# Altium project UNReLo End Node.PrjPcb (part 1 of 2)
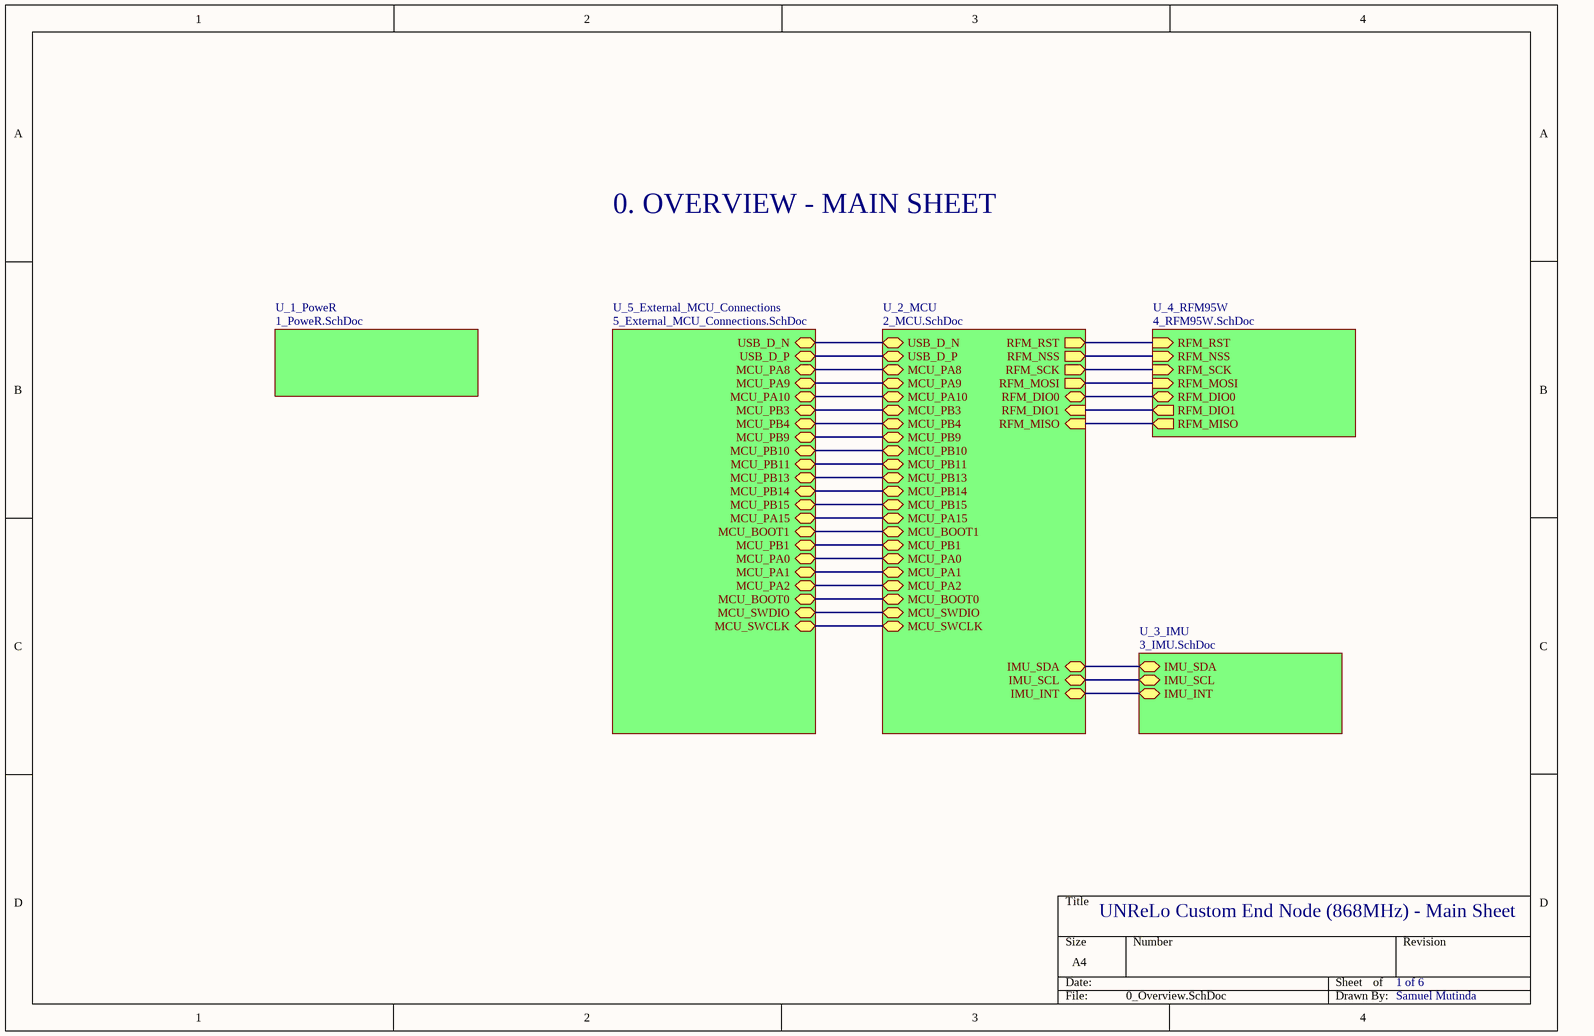
[diagram p0: 0_Overview.SchDoc]
6 sheets, 54 parts. Net scope: hierarchical (ports join the sheet entries above them; power ports are global).
Board file: UNReLo End Node PCB.PcbDoc
Sheets:
  0_Overview.SchDoc
    U_1_PoweR = 1_Power.SchDoc
    U_2_MCU = 2_MCU.SchDoc
    U_3_IMU = 3_IMU.SchDoc
    U_4_RFM95W = 4_RFM95W.SchDoc
    U_5_External_MCU_Connections = 5_External_MCU_Connections.SchDoc

## Sheet 0_Overview.SchDoc
size A4; SheetNumber: 1; SheetTotal: 6

### Sub-sheets
U_1_PoweR = 1_PoweR.SchDoc: no entries
U_2_MCU = 2_MCU.SchDoc: RFM_DIO0 (bidir), RFM_RST (out), RFM_NSS (out), RFM_SCK (out), RFM_MOSI (out), RFM_MISO (in), RFM_DIO1 (in), USB_D_N (bidir), USB_D_P (bidir), MCU_PA8 (bidir), MCU_PA9 (bidir), MCU_PA10 (bidir), MCU_PB3 (bidir), MCU_PB4 (bidir), MCU_PB9 (bidir), MCU_PB10 (bidir), MCU_PB11 (bidir), MCU_PB13 (bidir), MCU_PB14 (bidir), MCU_PB15 (bidir), MCU_PA15 (bidir), MCU_BOOT1 (bidir), MCU_PB1 (bidir), MCU_PA0 (bidir), MCU_PA1 (bidir), MCU_PA2 (bidir), MCU_BOOT0 (bidir), MCU_SWDIO (bidir), MCU_SWCLK (bidir), IMU_SCL (bidir), IMU_SDA (bidir), IMU_INT (bidir)
U_3_IMU = 3_IMU.SchDoc: IMU_SDA (bidir), IMU_SCL (bidir), IMU_INT (bidir)
U_4_RFM95W = 4_RFM95W.SchDoc: RFM_RST (in), RFM_NSS (in), RFM_SCK (in), RFM_MOSI (in), RFM_MISO (out), RFM_DIO0 (bidir), RFM_DIO1 (out)
U_5_External_MCU_Connections = 5_External_MCU_Connections.SchDoc: USB_D_N (bidir), USB_D_P (bidir), MCU_PA0 (bidir), MCU_PA1 (bidir), MCU_PA2 (bidir), MCU_PB1 (bidir), MCU_PB9 (bidir), MCU_PB10 (bidir), MCU_PB11 (bidir), MCU_PB13 (bidir), MCU_PB14 (bidir), MCU_PB15 (bidir), MCU_PB3 (bidir), MCU_PB4 (bidir), MCU_PA10 (bidir), MCU_PA9 (bidir), MCU_PA8 (bidir), MCU_BOOT0 (bidir), MCU_BOOT1 (bidir), MCU_SWDIO (bidir), MCU_SWCLK (bidir), MCU_PA15 (bidir)

### Nets
IMU_INT: sheet U_2_MCU/IMU_INT, sheet U_3_IMU/IMU_INT
IMU_SCL: sheet U_2_MCU/IMU_SCL, sheet U_3_IMU/IMU_SCL
IMU_SDA: sheet U_2_MCU/IMU_SDA, sheet U_3_IMU/IMU_SDA
MCU_BOOT0: sheet U_2_MCU/MCU_BOOT0, sheet U_5_External_MCU_Connections/MCU_BOOT0
MCU_BOOT1: sheet U_2_MCU/MCU_BOOT1, sheet U_5_External_MCU_Connections/MCU_BOOT1
MCU_PA0: sheet U_2_MCU/MCU_PA0, sheet U_5_External_MCU_Connections/MCU_PA0
MCU_PA1: sheet U_2_MCU/MCU_PA1, sheet U_5_External_MCU_Connections/MCU_PA1
MCU_PA2: sheet U_2_MCU/MCU_PA2, sheet U_5_External_MCU_Connections/MCU_PA2
MCU_PA8: sheet U_2_MCU/MCU_PA8, sheet U_5_External_MCU_Connections/MCU_PA8
MCU_PA9: sheet U_2_MCU/MCU_PA9, sheet U_5_External_MCU_Connections/MCU_PA9
MCU_PA10: sheet U_2_MCU/MCU_PA10, sheet U_5_External_MCU_Connections/MCU_PA10
MCU_PA15: sheet U_2_MCU/MCU_PA15, sheet U_5_External_MCU_Connections/MCU_PA15
MCU_PB1: sheet U_2_MCU/MCU_PB1, sheet U_5_External_MCU_Connections/MCU_PB1
MCU_PB3: sheet U_2_MCU/MCU_PB3, sheet U_5_External_MCU_Connections/MCU_PB3
MCU_PB4: sheet U_2_MCU/MCU_PB4, sheet U_5_External_MCU_Connections/MCU_PB4
MCU_PB9: sheet U_2_MCU/MCU_PB9, sheet U_5_External_MCU_Connections/MCU_PB9
MCU_PB10: sheet U_2_MCU/MCU_PB10, sheet U_5_External_MCU_Connections/MCU_PB10
MCU_PB11: sheet U_2_MCU/MCU_PB11, sheet U_5_External_MCU_Connections/MCU_PB11
MCU_PB13: sheet U_2_MCU/MCU_PB13, sheet U_5_External_MCU_Connections/MCU_PB13
MCU_PB14: sheet U_2_MCU/MCU_PB14, sheet U_5_External_MCU_Connections/MCU_PB14
MCU_PB15: sheet U_2_MCU/MCU_PB15, sheet U_5_External_MCU_Connections/MCU_PB15
MCU_SWCLK: sheet U_2_MCU/MCU_SWCLK, sheet U_5_External_MCU_Connections/MCU_SWCLK
MCU_SWDIO: sheet U_2_MCU/MCU_SWDIO, sheet U_5_External_MCU_Connections/MCU_SWDIO
RFM_DIO0: sheet U_2_MCU/RFM_DIO0, sheet U_4_RFM95W/RFM_DIO0
RFM_DIO1: sheet U_2_MCU/RFM_DIO1, sheet U_4_RFM95W/RFM_DIO1
RFM_MISO: sheet U_2_MCU/RFM_MISO, sheet U_4_RFM95W/RFM_MISO
RFM_MOSI: sheet U_2_MCU/RFM_MOSI, sheet U_4_RFM95W/RFM_MOSI
RFM_NSS: sheet U_2_MCU/RFM_NSS, sheet U_4_RFM95W/RFM_NSS
RFM_RST: sheet U_2_MCU/RFM_RST, sheet U_4_RFM95W/RFM_RST
RFM_SCK: sheet U_2_MCU/RFM_SCK, sheet U_4_RFM95W/RFM_SCK
USB_D_N: sheet U_2_MCU/USB_D_N, sheet U_5_External_MCU_Connections/USB_D_N
USB_D_P: sheet U_2_MCU/USB_D_P, sheet U_5_External_MCU_Connections/USB_D_P

### Notes on the sheet
- 0. OVERVIEW - MAIN SHEET
- UNReLo Custom End Node (868MHz) - Main Sheet
- 1 of 6
- Samuel Mutinda

## Sheet 1_Power.SchDoc
size A4; SheetNumber: 2; SheetTotal: 6
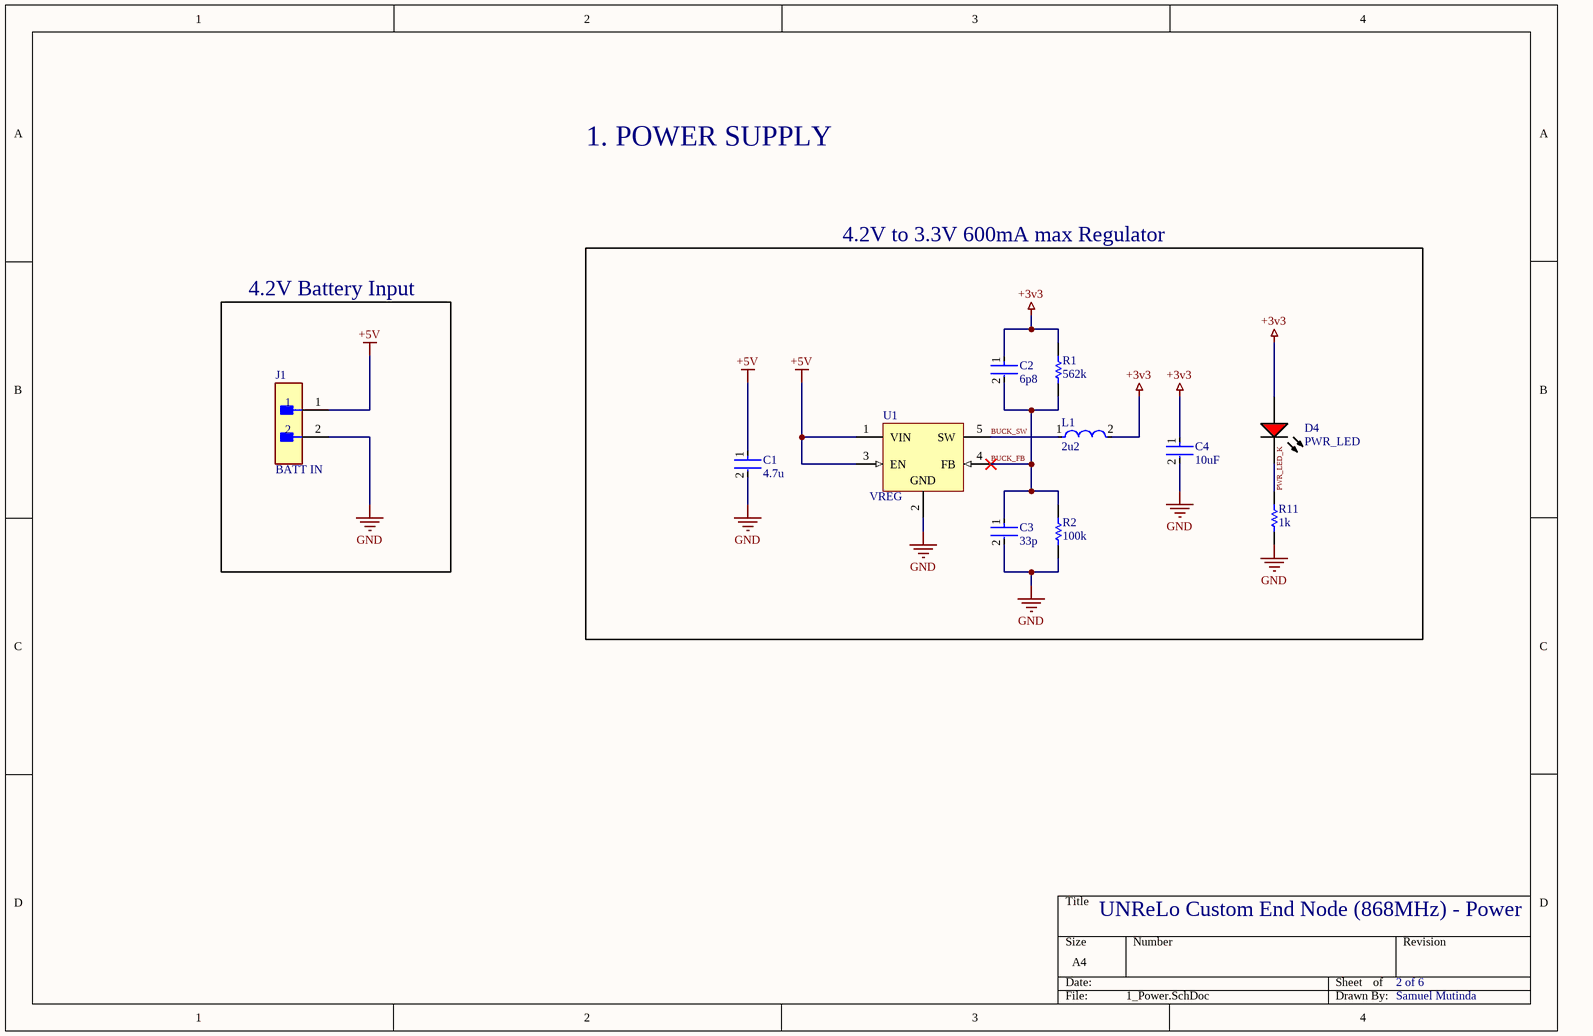
[diagram p1: 1_Power.SchDoc]

### Parts
C1  4.7u  [FP-GRM155-0_1-IPC_B]
C2  6p8  [FP-C0603C-CF-MFG]
C3  33p  [FP-CC0603-0_9-IPC_C]
C4  10uF  [FP-GRM188-0_1-e0_2_0_55-IPC_A]
D4  PWR_LED  [VISH-TLMS1000_V]
J1  BATT IN  [FP-53254-0270-MFG]
L1  2u2  [FP-LQM21PH_G0-IPC_C]
R1  562k  [RESC1609X50X30NL10T20]
R2  100k  [RESC1608X55X30ML20T20]
R11  1k  [RESC1005X40X25NL05T05]
U1  VREG  [DBV0005A_L]

### Blocks framed on the sheet
4.2V Battery Input: J1
4.2V to 3.3V 600mA max Regulator: C1-C4 D4 L1 R1 R2 R11 U1

### Nets
+3v3: C2.1 C4.1 D4.1(A) L1.2 R1.2
+5V: C1.1 J1.1 U1.1(VIN) U1.3(EN)
GND: C1.2 C3.2 C4.2 J1.2 R2.1 R11.1 U1.2(GND)
BUCK_FB: C2.2 C3.1 R1.1 R2.2 U1.4(FB)
BUCK_SW: L1.1 U1.5(SW)
PWR_LED_K: D4.2(K) R11.2

### Notes on the sheet
- 1. POWER SUPPLY
- UNReLo Custom End Node (868MHz) - Power
- 2 of 6
- Samuel Mutinda

### Library data of the parts
C1 = CMP-2008-04549-2: Chip Multilayer Ceramic Capacitors for General Purpose, 0402, 4.7uF, X5R, 15%, 20%, 6.3V; Manufacturer 1: Samsung Electro-Mechanics; Voltage Rating (DC): 16V; Name: CL05A475MO5NUNC; Height: 0.5mm; Weight: 0.000212oz; Length: 1mm; Case Code (Metric): 1005; Packaging: Tape and Reel; Termination: SMD/SMT; Dielectric: X5R; Depth: 0.5mm; Case Code (Imperial): 0402; Min Operating Temperature: -55°C; Case/Package: 0402; Voltage: 6.3V; Width: 0.02inch; Capacitance: 4.7uF; Lead Free: Lead Free; Thickness: 0.022inch; Contact Plating: Tin; REACH SVHC: No SVHC; Package Quantity: 10000; Tolerance: 20%; Voltage Rating: 16V; Mount: Surface Mount; Max Operating Temperature: 85°C; Manufacturer Part Number 1: CL05A475MO5NUNC; Supplier 1: Digi-Key; Supplier Part Number 1: 1276-6836-1-ND; Supplier Unit Price 1: $0.44
C2 = CMP-2006-03271-2: CAP CER 6.8PF 50V NP0 0603; Manufacturer Part Number: C0603C689C5GACTU; Manufacturer: KEMET; Manufacturer 1: TDK Corporation; Manufacturer Part Number 1: C1608CH2A6R8D080AA; Automotive Grade: Grade 1; Temperature Coefficient: 30ppm/°C; Temperature Characteristic: C0G; Tolerance: 0.25 pF; Material: Ceramic; Voltage Rating: 100 V; ComponentLink2URL: https://api.kemet.com/component-edge/download/datasheet/C0603C100J5GACAUTO.pdf; Mouser Description: 0603 C 6.8pF Ceramic Multilayer Capacitor; 50V dc; +125C; C0G Dielectric; +/-0.25pF; Temperature Range High: +125°C; Device Class L1: Passive Components; Temperature: -55°C to +125°C; Digikey Description: CAP CER 6.8PF 50V NP0 0603; Device Class L2: Capacitors; Automotive: Yes; Octopart: https://octopart.com/c0603c689c5gactu-kemet-8718591; Category: Cap; ComponentLink2Description: Datasheet; RoHS: TRUE; Capacitance: 6.8 pF; Value: 6.8 pF; Lead Free: Yes; Device Class L3: Ceramic Capacitors; Package: C0603C-CF; Temperature Range Low: -55°C; Height: 0.87mm; Supplier 1: Digi-Key; Supplier Unit Price 1: $0.14; Supplier Part Number 1: 445-11157-1-ND; Name: C1608CH2A6R8D080AA
C3 = CMP-2000-06072-2: CAP CER 33PF 50V C0G/NPO 0603; Manufacturer 1: KEMET; Manufacturer Part Number 1: C0603H330J5GAC7867; Tolerance: 5%; Temperature Coefficient: 30ppm/°C; Dielectric: C0G; Insulation Resistance: 100GR; Dielectric Material: Ceramic; Voltage Rating (DC): 50V; Capacitance: 33pF; Voltage: 50V; Resistor Type: Ceramic; Lead Free: Lead Free; Mount: Surface Mount; Case Code (Imperial): 0603; Min Operating Temperature: -55°C; Package Quantity: 1; Case Code (Metric): 1608; Radiation Hardening: No; Packaging: Tape and Reel; Length: 1.6mm; Width: 0.031inch; Termination: SMD/SMT; Max Operating Temperature: 125°C; Series: CC; Case/Package: 0603; RoHS Compliant: Yes; Number of Pins: 2; REACH SVHC: No SVHC; Thickness: 0.035inch; Depth: 0.8mm; Voltage Rating: 50V; Height: 0.8mm; Supplier 1: Digi-Key; Supplier Unit Price 1: 0.76; Supplier Part Number 1: 399-17603-1-ND; Name: C0603H330J5GAC7867
C4 = CMP-2006-02792-2: 10 µF ±10% 10V Ceramic Capacitor X5R 0603 (1608 Metric); Manufacturer 1: Murata Electronics; Manufacturer Part Number 1: GRT188R61A106KE13D; Voltage: 6.3V; Tolerance: 20%; Packaging: Tape and Reel; Voltage Rating (DC): 10V; Width: 0.031inch; Termination: SMD/SMT; Dielectric: X5R; Package Quantity: 4000; Voltage Rating: 10V; Capacitance: 10uF; Case/Package: 0603; Min Operating Temperature: -55°C; Length: 1.6mm; Thickness: 0.035inch; Lead Free: Lead Free; Depth: 0.8mm; Case Code (Imperial): 0603; Max Operating Temperature: 85°C; Material: Ceramic; Height: 0.8mm; Mount: Surface Mount; REACH SVHC: No SVHC; Radiation Hardening: No; Case Code (Metric): 1608; Supplier 1: Digi-Key; Supplier Unit Price 1: $0.36; Supplier Part Number 1: 490-12311-1-ND; Name: GRT188R61A106KE13D
D4 = CMP-2000-07254-1: Low Current LED, 40 mW, 1.8 V, -40 to 100 degC, 2-Pin SMD (0603), RoHS, Tape and Reel; Manufacturer: Vishay; Lens Shape: Rectangular; Automotive Qualification Standard: AEC-Q100; Wavelength Typ: 636nm; SVHC: ToBeAdvised; LED Colour: Red; Bulb Size: 1.6mmx0.8mm; Forward Voltage: 1.8V; Luminous Intensity: 4mcd; Forward Current If: 2mA; Viewing Angle: 80°; JLCPCB Part #: C2286; Datasheet URL: https://datasheet.ciiva.com/5798/1698881-5798337.pdf; LED Mounting: SMD; Packaging: CutTape; Package Reference: TLMS1000; Manufacturer URL: http://www.vishay.com/; Mounting Technology: SurfaceMount; Product Range: -; Package Description: 2-Pin Surface Mount Device, Body 1.6 x 0.8 mm; MSL: MSL2-1year
J1 = CMP-04776-000342-1: CONN HEADER R/A 2POS 2MM; Manufacturer 1: Sullins Connector Solutions; Max Current Rating: 3A; Max Voltage Rating (DC): 250V; Number of Positions: 2; Voltage Rating: 125V; Contact Resistance: 20mR; Gender: Male; Current Rating: 2A; Glow Wire Compliant: Non-compliant; Name: SWR201-NRTN-S02-RL-WH; Series: 53254; Packaging: Tray; Max Operating Temperature: 105°C; Depth: 13.59mm; Contact Plating: Tin; Orientation: Right Angle; Number of Circuits: 2; Number of Contacts: 2; Termination: Through Hole; Radiation Hardening: No; Max Voltage Rating (AC): 125V; Min Operating Temperature: -40°C; Housing Material: Nylon; Housing Color: Black; RoHS Compliant: Yes; Number of Rows: 1; Length: 11.07mm; Package Quantity: 2000; Contact Material: Brass; Mount: Through Hole; Contact Gender: Male; Pitch: 2mm; Height: 6.99mm; Manufacturer Part Number 1: SWR201-NRTN-S02-RL-WH; Supplier 1: Digi-Key; Supplier Part Number 1: S9443-ND; Supplier Unit Price 1: $0.13
L1 = CMP-06042-016317-1: 2.2 µH Unshielded Multilayer Inductor 900 mA 170mOhm Max 0806 (2016 Metric); Manufacturer 1: Walsin Technology Corporation; Manufacturer Part Number 1: WLFM201209M2R2PC; Test Frequency: 1MHz; Inductance Tolerance: 30%; Current Rating: 800mA; Self Resonant Frequency: 40MHz; Core Material: Ferrite; Inductance: 2.2uH; DC Resistance (DCR): 288mR; RoHS Compliant: Yes; REACH SVHC: No SVHC; Package Quantity: 4000; Military Standard: Not; Max Operating Temperature: 125°C; Radiation Hardening: No; Series: LQM; Height - Seated (Max): 0.039inch; Tolerance: 30%; Shielding: Shielded; Height: 0.9mm; Lead Free: Lead Free; Case Code (Metric): 2012; Packaging: Tape and Reel; Termination: SMD/SMT; Case Code (Imperial): 0805; Min Operating Temperature: -55°C; Depth: 1.4mm; Mount: Surface Mount; Length: 2mm; DC Current: 800mA; Case/Package: 0805; Max DC Current: 800mA; Width: 0.049inch; Supplier 1: Digi-Key; Supplier Unit Price 1: 0.1; Supplier Part Number 1: 1292-WLFM201209M2R2PCCT-ND; Name: WLFM201209M2R2PC
R1 = CMP-2000-03465-1: Manufacturer 1: Vishay Dale; Manufacturer Part Number 1: CRCW0603562KFKEA; Supplier 1: Digi-Key; Supplier Unit Price 1: $0.1; Supplier Part Number 1: 541-562KHCT-ND; Parameter 1: *; Name: CRCW0603562KFKEA
R2 = CMP-2000-00875-1: 100 kOhms ±0.1% 0.1W, 1/10W Chip Resistor 0603 (1608 Metric) Automotive AEC-Q200 Thin Film; Manufacturer 1: Panasonic Electronic Components; Name: ERA-3AEB104V; Supplier 1: Digi-Key; Manufacturer Part Number 1: ERA-3AEB104V; Supplier Unit Price 1: $0.35; Supplier Part Number 1: P100KDBCT-ND
R11 = CMP-1011-00510-4: Chip Resistor, 1 KOhm, +/- 1%, 100 mW, -55 to 155 degC, 0402 (1005 Metric), RoHS, Tape and Reel; Manufacturer 1: Panasonic Electronic Components; Manufacturer Part Number 1: ERJ-2RKF1001X; Voltage Rating: 50 V; Case\/Package: 0402; Resistance: 1 KOhm; Power Rating: 100 mW; DatasheetVersion: 04/2015; Radiation Hardening: No; Pins: 2; Height: 0.35 mm; RoHSCompliant: true; Case Code (Imperial): 0402; ComponentLink2Description: Datasheet; ComponentLink1Description: Manufacturer URL; PackageReference: 0402; Mount: Surface Mount; Package Quantity: 10000; Tolerance: 1%; ComponentLink1URL: http://www.panasonic.com/; PackageDescription: 2-Pin Surface Mount Device, Body 1 x 0.5 mm; Mounting Technology: Surface Mount; Case Code (Metric): 1005; ComponentLink2URL: http://industrial.panasonic.com/cdbs/www-data/pdf/RDA0000/AOA0000C86.pdf; REACH SVHC: Yes; Packaging: Tape and Reel; Max Operating Temperature: 155 degC; Min Operating Temperature: -55 degC; Width: 0.5 mm; Length: 1 mm; Supplier 1: Digi-Key; Supplier Unit Price 1: $0.1; Supplier Part Number 1: P1.00KLCT-ND; Name: ERJ-2RKF1001X
U1 = CMP-0063-01053-3: 2MHz, 600mA Step-Down DC-DC Converter, 5-pin SOT-23, Pb-Free; Manufacturer: Texas Instruments; Manufacturer Part Number 1: LM3674MF-ADJ/NOPB; PackageTopMarking: SLTB*XTT; PowerWise: Y; CompType: MiscPower; ComponentLink1URL: http://www.ti.com/general/docs/lit/getliterature.tsp?genericPartNumber=LM3674&fileType=pdf; RoHS: Y; PinCount: 5; PackageReference: DBV0005A; PackageDescription: Molded SOT-23, .115 x .063 x .040 in Body, 5 Lead, .0375 in Pitch; ComponentLink1Description: Datasheet URL; Name: LM3674MF-ADJ/NOPB; Supplier Part Number 1: LM3674MF-ADJ/NOPBCT-ND; Supplier Unit Price 1: $1.74; Supplier 1: Digi-Key

## Sheet 2_MCU.SchDoc
size A4; SheetNumber: 3; SheetTotal: 6; SPICEModelCacheTOFGAPIR: <root> / <DocumentId>TOFGAPIR</DocumentId> / </root>
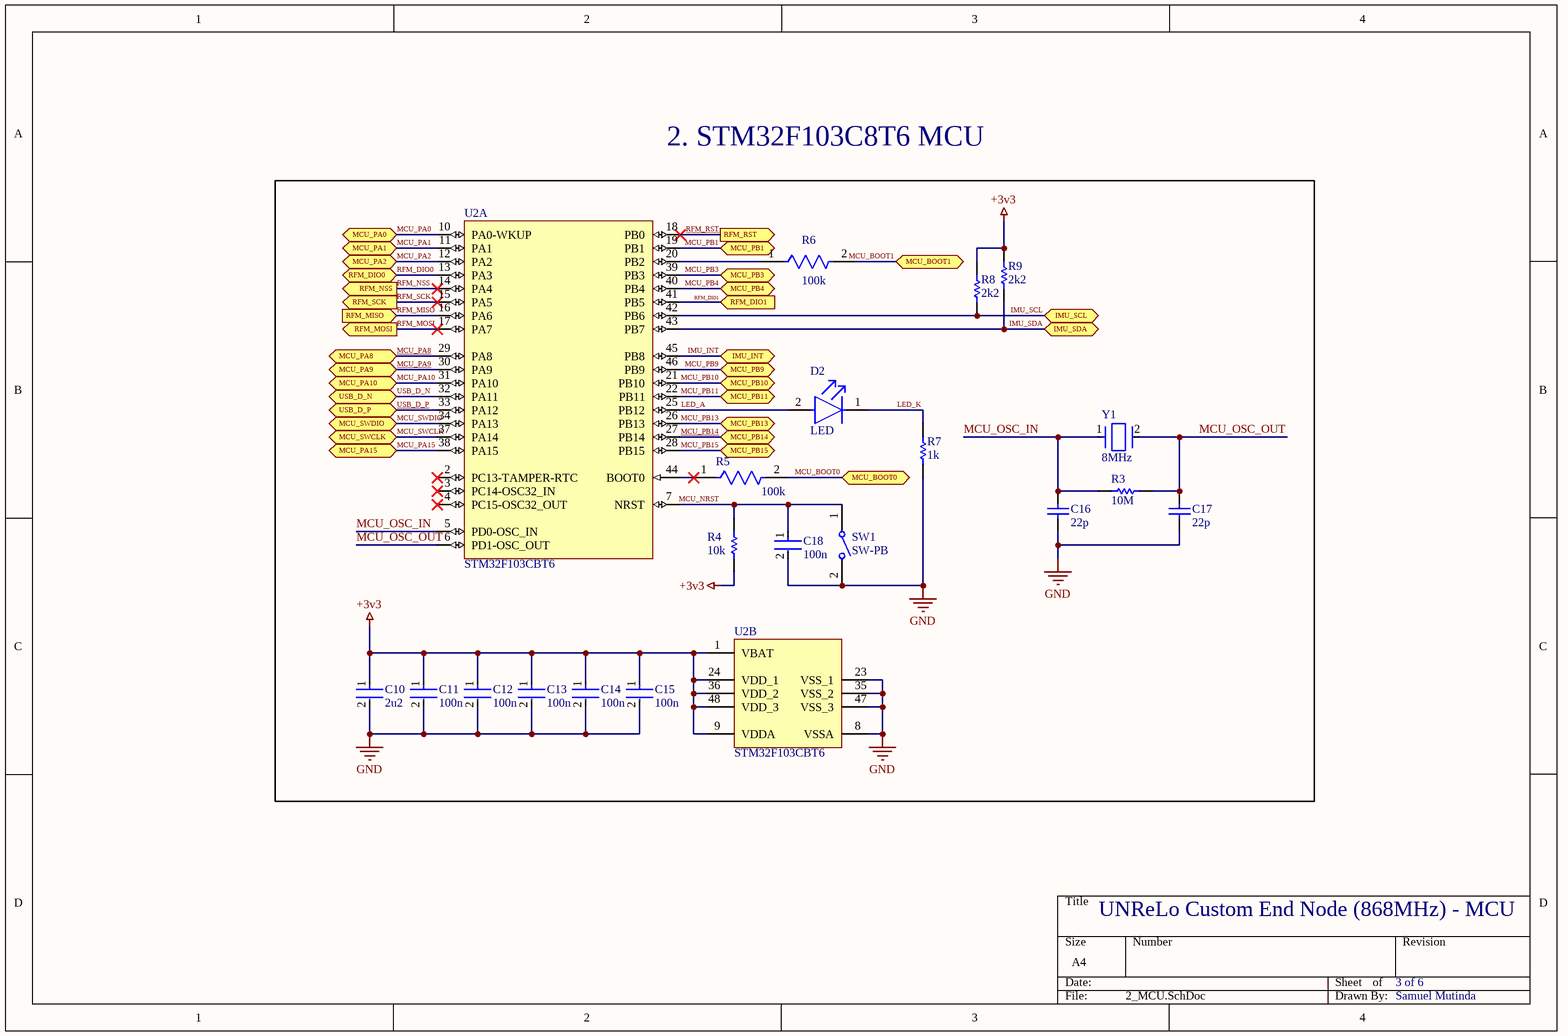
[diagram p2: 2_MCU.SchDoc]

### Parts
C10  2u2  [FP-C0603C225K4PACTU-MFG]
C11  100n  [FP-C0402-BB-MFG]
C12  100n  [FP-C0402-BB-MFG]
C13  100n  [FP-C0402-BB-MFG]
C14  100n  [FP-C0402-BB-MFG]
C15  100n  [FP-C0402-BB-MFG]
C16  22p  [CAPC1006X50X20ML10T10]
C17  22p  [CAPC1006X50X20ML10T10]
C18  100n  [FP-C0402-BB-MFG]
D2  LED  [FP-LTST-C191TBKT-MFG]
R3  10M  [RESC1005X40X25LL05T05]
R4  10k  [RESC1005X40X25LL05T05]
R5  100k  [FP-ERJ2RK-IPC_C]
R6  100k  [FP-ERJ2RK-IPC_C]
R7  1k  [RESC1005X40X25NL05T05]
R8  2k2  [RESC1005X40X25NL05T10]
R9  2k2  [RESC1005X40X25NL05T10]
SW1  SW-PB  [TECO-FSMSM-2_V]
U2  STM32F103CBT6  [STM-LQFP48_L]  (parts A,B of 2)
Y1  8MHz  [FP-ABLS-MFG]

### Ports
IMU_INT (bidir), IMU_SCL (bidir), IMU_SDA (bidir), MCU_BOOT0 (bidir), MCU_BOOT1 (bidir), MCU_PA0 (bidir), MCU_PA1 (bidir), MCU_PA2 (bidir), MCU_PA8 (bidir), MCU_PA9 (bidir), MCU_PA10 (bidir), MCU_PA15 (bidir), MCU_PB1 (bidir), MCU_PB3 (bidir), MCU_PB4 (bidir), MCU_PB9 (bidir), MCU_PB10 (bidir), MCU_PB11 (bidir), MCU_PB13 (bidir), MCU_PB14 (bidir), MCU_PB15 (bidir), MCU_SWCLK (bidir), MCU_SWDIO (bidir), RFM_DIO0 (bidir), RFM_DIO1 (in), RFM_MISO (in), RFM_MOSI (out), RFM_NSS (out), RFM_RST (out), RFM_SCK (out), USB_D_N (bidir), USB_D_P (bidir)

### Nets
+3v3: C10.1 C11.1 C12.1 C13.1 C14.1 C15.1 R4.1 R8.2 R9.2 U2.1(VBAT) U2.9(VDDA) U2.24(VDD_1) U2.36(VDD_2) U2.48(VDD_3)
GND: C10.2 C11.2 C12.2 C13.2 C14.2 C15.2 C16.1 C17.1 C18.2 R7.1 SW1.2 U2.8(VSSA) U2.23(VSS_1) U2.35(VSS_2) U2.47(VSS_3)
IMU_INT: U2.45(PB8) ; port IMU_INT
IMU_SCL: R8.1 U2.42(PB6) ; port IMU_SCL
IMU_SDA: R9.1 U2.43(PB7) ; port IMU_SDA
LED_A: D2.2(A) U2.25(PB12)
LED_K: D2.1(C) R7.2
MCU_BOOT0: R5.2 ; port MCU_BOOT0
MCU_BOOT1: R6.2 ; port MCU_BOOT1
MCU_NRST: C18.1 R4.2 SW1.1 U2.7(NRST)
MCU_OSC_IN: C16.2 R3.1 U2.5(PD0-OSC_IN) Y1.1
MCU_OSC_OUT: C17.2 R3.2 U2.6(PD1-OSC_OUT) Y1.2
MCU_PA0: U2.10(PA0-WKUP) ; port MCU_PA0
MCU_PA1: U2.11(PA1) ; port MCU_PA1
MCU_PA2: U2.12(PA2) ; port MCU_PA2
MCU_PA8: U2.29(PA8) ; port MCU_PA8
MCU_PA9: U2.30(PA9) ; port MCU_PA9
MCU_PA10: U2.31(PA10) ; port MCU_PA10
MCU_PA15: U2.38(PA15) ; port MCU_PA15
MCU_PB1: U2.19(PB1) ; port MCU_PB1
MCU_PB3: U2.39(PB3) ; port MCU_PB3
MCU_PB4: U2.40(PB4) ; port MCU_PB4
MCU_PB9: U2.46(PB9) ; port MCU_PB9
MCU_PB10: U2.21(PB10) ; port MCU_PB10
MCU_PB11: U2.22(PB11) ; port MCU_PB11
MCU_PB13: U2.26(PB13) ; port MCU_PB13
MCU_PB14: U2.27(PB14) ; port MCU_PB14
MCU_PB15: U2.28(PB15) ; port MCU_PB15
MCU_SWCLK: U2.37(PA14) ; port MCU_SWCLK
MCU_SWDIO: U2.34(PA13) ; port MCU_SWDIO
RFM_DIO0: U2.13(PA3) ; port RFM_DIO0
RFM_DIO1: U2.41(PB5) ; port RFM_DIO1
RFM_MISO: U2.16(PA6) ; port RFM_MISO
RFM_MOSI: U2.17(PA7) ; port RFM_MOSI
RFM_NSS: U2.14(PA4) ; port RFM_NSS
RFM_RST: U2.18(PB0) ; port RFM_RST
RFM_SCK: U2.15(PA5) ; port RFM_SCK
USB_D_N: U2.32(PA11) ; port USB_D_N
USB_D_P: U2.33(PA12) ; port USB_D_P
NetR5_1: R5.1 U2.44(BOOT0)
NetR6_1: R6.1 U2.20(PB2)

Not connected (* = marked no-connect by the designer): U2 2(PC13-TAMPER-RTC)* 3(PC14-OSC32_IN)* 4(PC15-OSC32_OUT)*

### Notes on the sheet
- 2. STM32F103C8T6 MCU
- UNReLo Custom End Node (868MHz) - MCU
- 3 of 6
- Samuel Mutinda

### Library data of the parts
C10 = CMP-2006-02259-2: CAP CER 2.2UF 16V X5R 0603; Manufacturer 1: Taiyo Yuden; Dielectric Material: Ceramic; Tolerance: 10%; Dissipation Factor: 5%; Name: EMK107BB7225MA-T; Series: C; Voltage Rating (DC): 16V; REACH SVHC: No SVHC; RoHS Compliant: Yes; Number of Pins: 2; Max Operating Temperature: 85°C; Voltage Rating: 16V; Min Operating Temperature: -55°C; Termination: SMD/SMT; Dielectric: X5R; Packaging: Tape and Reel; Contact Plating: Tin; Case Code (Metric): 1608; Height: 0.8mm; Capacitance: 2.2uF; Case/Package: 0603; Width: 0.8mm; Construction: Flat; Depth: 0.8mm; Thickness: 0.034inch; Radiation Hardening: No; Length: 1.6mm; Mount: Surface Mount; Case Code (Imperial): 0603; Voltage: 16V; Package Quantity: 1; Lead Free: Lead Free; Manufacturer Part Number 1: EMK107BB7225MA-T; Supplier 1: Digi-Key; Supplier Part Number 1: 587-4864-1-ND; Supplier Unit Price 1: $0.27
C11-C15 C18 = CMP-1034-02068-3: CAP CER 0.1UF 16V 10% X7R 0402; Manufacturer 1: TDK Corporation; Value: 0.10 μF; Temperature Coefficient: 15%; Tolerance: 0.1; Material: Ceramic; Name: CGA2B1X7R1C104K050BC; ComponentLink2URL: https://content.kemet.com/datasheets/KEM_C1002_X7R_SMD.pdf; Automotive: No; Device Class L2: Capacitors; Temperature: -55°C to +125°C; RoHS: TRUE; Voltage Rating: 16 V; ComponentLink2Description: Datasheet; Device Class L3: Ceramic Capacitors; Temperature Range Low: -55°C; Ipc Land Pattern Name: CAPC10050X50; Device Class L1: Passive Components; Temperature Range High: +125°C; Package: C0402-BB; Capacitance: 0.10 μF; Category: Cap; Mouser Description: CAP CER 0.1UF 16V X7R 0402; Height: 0.55mm; Digikey Description: CAP CER 0.1UF 16V 5% X7R 0402; Octopart: https://octopart.com/c0402c104j4ractu-kemet-12573893; Temperature Characteristic: X7R; Lead Free: Yes; Manufacturer Part Number 1: CGA2B1X7R1C104K050BC; Supplier 1: Digi-Key; Supplier Part Number 1: 445-5613-1-ND; Supplier Unit Price 1: $0.1
C16 C17 = CMP-2008-04844-1: Manufacturer 1: Murata Electronics; Name: GCM1555G1H220JA16D; Manufacturer Part Number 1: GCM1555G1H220JA16D; Supplier 1: Digi-Key; Supplier Part Number 1: 490-GCM1555G1H220JA16DCT-ND; Supplier Unit Price 1: $0.1
D2 = CMP-22017-000008-1: LED WHITE; Lens Color: Colorless; Dominant Wavelength: 475nm; Forward Current: 20mA; Wavelength: 468nm; Viewing Angle: 130°; Lens Transparency: Clear; Power Dissipation: 76mW; Illumination Color: Blue; Luminous Intensity: 180mcd; Reverse Voltage: 5V; Number of Elements: 1; Lens Style: Diffused; Forward Voltage: 3.8V; Max Power Dissipation: 75mW; Case Code (Metric): 1608; Packaging: Tape and Reel; Case/Package: 0603; Depth: 1.6mm; Mount: Surface Mount; Lead Free: Lead Free; Min Operating Temperature: -20°C; Height: 0.55mm; Test Current: 20mA; Case Code (Imperial): 0603; Max Operating Temperature: 80°C; Number of Pins: 2; Length: 0.8mm; Radiation Hardening: No; Package Quantity: 1; Number of LEDs: 1; Width: 0.8mm; Color: Blue
R3 = CMP-1011-00962-2: Manufacturer 1: Vishay Dale; Name: CRCW040210M0FKED; Manufacturer Part Number 1: CRCW040210M0FKED; Supplier 1: Digi-Key; Supplier Part Number 1: 541-10.0MLCT-ND; Supplier Unit Price 1: $0.1
R4 = CMP-2000-07588-1: Chip Resistor, 10 KOhm, +/- 1%, 0.1 W, -55 to 155 degC, 0402 (1005 Metric), RoHS, Tape and Reel; Manufacturer 1: Vishay Beyschlag/Draloric/BC Components; Power Rating: 100mW; Voltage Rating: 50V; Resistance: 10KOhm; Case\/Package: 0402; Temperature Coefficient: 100ppm\/degreesC; Name: MCS04020C1002FE000; RoHSCompliant: True; Lead Free: LeadFree; Package Quantity: 1; Contact Plating: Tin; Length: 1mm; Radiation Hardening: No; REACH SVHC: NoSVHC; Max Operating Temperature: 155degC; Depth: 0.5mm; Case Code (Imperial): 0402; Military Standard: Not; Package Description: 2-Pin Surface Mount Device, Body 1 x 0.5 mm; Termination: SMD/SMT; Case Code (Metric): 1005; Height: 0.35mm; Packaging: TapeandReel; Voltage Rating (DC): 50V; Package Reference: 402; Number of Pins: 2; Tolerance: 1%; Mounting Technology: SurfaceMount; Width: 0.02inch; Mount: SurfaceMount; Datasheet URL: https://industrial.panasonic.com/cdbs/www-data/pdf/RDA0000/AOA0000C304.pdf; Composition: ThickFilm; Datasheet Version: 02/2017; Max Power Dissipation: 100mW; Number of Terminations: 2; Min Operating Temperature: -55degC; Manufacturer Part Number 1: MCS04020C1002FE000; Supplier 1: Digi-Key; Supplier Part Number 1: MCS0402-10.0K-CFCT-ND; Supplier Unit Price 1: $0.15
R5 R6 = CMP-2002-00608-4: RES SMD 100K OHM 1% 1/10W 0402; Manufacturer 1: Panasonic Electronic Components; Resistance: 100kR; Voltage Rating (DC): 50V; Power Rating: 100mW; Temperature Coefficient: 100ppm/°C; Name: ERJ-PA2J104X; Case/Package: 0402; Length: 1mm; Package Quantity: 1; Radiation Hardening: No; Case Code (Metric): 1005; Contact Plating: Tin; Mount: Surface Mount; Depth: 0.5mm; Max Operating Temperature: 155°C; Lead Free: Lead Free; Width: 0.5mm; Composition: Thick Film; Case Code (Imperial): 0402; Tolerance: 1%; Termination: SMD/SMT; Number of Pins: 2; Height: 0.35mm; Voltage Rating: 50V; Military Standard: Not; REACH SVHC: No SVHC; Packaging: Tape and Reel; Min Operating Temperature: -55°C; Max Power Dissipation: 100mW; Features: Automotive AEC-Q200; Number of Terminations: 2; Manufacturer Part Number 1: ERJ-PA2J104X; Supplier 1: Digi-Key; Supplier Part Number 1: P17205CT-ND; Supplier Unit Price 1: $0.16
R7 = CMP-1011-00510-4: Chip Resistor, 1 KOhm, +/- 1%, 100 mW, -55 to 155 degC, 0402 (1005 Metric), RoHS, Tape and Reel; Manufacturer: Basic Passives; Manufacturer 1: Panasonic Electronic Components; Voltage Rating: 50 V; Case\/Package: 0402; Resistance: 1 KOhm; Power Rating: 100 mW; Name: ERJ-2RKF1001X; DatasheetVersion: 04/2015; Radiation Hardening: No; Pins: 2; Height: 0.35 mm; RoHSCompliant: true; Case Code (Imperial): 0402; ComponentLink2Description: Datasheet; ComponentLink1Description: Manufacturer URL; PackageReference: 0402; Mount: Surface Mount; Package Quantity: 10000; Tolerance: 1%; ComponentLink1URL: http://www.panasonic.com/; PackageDescription: 2-Pin Surface Mount Device, Body 1 x 0.5 mm; Mounting Technology: Surface Mount; Case Code (Metric): 1005; ComponentLink2URL: http://industrial.panasonic.com/cdbs/www-data/pdf/RDA0000/AOA0000C86.pdf; REACH SVHC: Yes; Packaging: Tape and Reel; Max Operating Temperature: 155 degC; Min Operating Temperature: -55 degC; Width: 0.5 mm; Length: 1 mm; Manufacturer Part Number 1: ERJ-2RKF1001X; Supplier 1: Digi-Key; Supplier Part Number 1: P1.00KLCT-ND; Supplier Unit Price 1: $0.10
R8 R9 = CMP-2002-07567-1: Manufacturer 1: YAGEO; Name: RC0402FR-072K2L; Manufacturer Part Number 1: RC0402FR-072K2L; Supplier 1: Digi-Key; Supplier Part Number 1: 311-2.20KLRCT-ND; Supplier Unit Price 1: $0.1
SW1 = CMP-2000-07511-1: FSMSM Push Button Switch, 50 mA, -35 to 85 degC, 2-Pin SMD, RoHS, Bulk; Manufacturer: TE Connectivity; Manufacturer 1: TE Connectivity ALCOSWITCH Switches; Actuator Length: 1.07mm; Electrical Life: 20000Cycles; Actuator Material: Polyamide; Current Rating: 50mA; Illumination Type: Illuminated; Voltage Rating (DC): 24V; Contact Resistance: 100mOhm; Case\/Package: SMD/SMT; Operating Force: 180gf; Switch Travel: 0.25mm; Max Voltage Rating (DC): 12V; Throw Configuration: SPST; Packaging: LoosePiece; Max Operating Temperature: 85degC; ELV: Compliant; Package Description: 2-Pin Surface Mount Device, Body 6 x 3.5 mm, Pitch 9.19 mm; RoHSCompliant: true; Manufacturer URL: http://www.te.com/; Contact Plating: Silver; Contact Material: Brass; Mounting Technology: SurfaceMount; Contact Current Rating: 50mA; Datasheet Version: Rev. C2, 08/2014; Datasheet URL: http://www.te.com/commerce/DocumentDelivery/DDEController?Action=showdoc&DocId=Customer+Drawing%7F1437566-3%7FC2%7Fpdf%7FEnglish%7FENG_CD_1437566-3_C2_1437566_3_1_c.dwg.pdf%7F1437566-3; Mechanical Life: 20000Cycles; Package Reference: FSMSM; REACH SVHC: Unknown; Orientation: Straight; Min Operating Temperature: -35degC; Lead Free: LeadFree; Termination: GullWing; Package Quantity: 1000; Mount: SurfaceMount; Name: FSMSM; Manufacturer Part Number 1: FSMSM; Supplier 1: Digi-Key; Supplier Part Number 1: 450-1140-ND; Supplier Unit Price 1: $0.32
U2 = CMP-0237-00250-3: ARM Cortex-M3 32-bit MCU, 128 KB Flash, 20 KB Internal RAM, 37 I/Os, 48-pin LQFP, -40 to 85 degC, Tray; Manufacturer 1: STMicroelectronics; Supply Voltage(Vcc) min (V): 2; Operating Frequency(F) (Processor speed) (MHz): 72; A/D Converter: 2x12-bit (10 Channel); FLASH Size (Prog) (kB): 128; Internal RAM Size (kB): 20; I/Os (High Current): 37; ComponentLink2Description: Datasheet; PackageReference: LQFP48; ComponentLink1Description: Manufacturer URL; DatasheetVersion: Rev. 16; PackageVersion: Rev. 6, 06/2013; Packing: Tray; ComponentLink1URL: http://www.st.com/web/en/home.html; Mounting Technology: Surface Mount; ComponentLink3URL: http://www.st.com/st-web-ui/static/active/en/resource/technical/document/datasheet/DM00058181.pdf; PackageDescription: 48-Pin Low Profile Quad Flat Package, 7 x 7 mm Body, 0.5 mm Pitch; Core: ARM Cortex-M3; ComponentLink3Description: Package Specification; ComponentLink2URL: http://www.st.com/st-web-ui/static/active/en/resource/technical/document/datasheet/CD00161566.pdf; Name: STM32F103CBT6; Manufacturer Part Number 1: STM32F103CBT6; Supplier 1: Digi-Key; Supplier Part Number 1: 497-6288-ND; Supplier Unit Price 1: $7.66
Y1 = CMP-27762-009874-1: CRYSTAL 8.0000MHZ 18PF SMD; Manufacturer 1: Abracon LLC; ESR (Equivalent Series Resistance): 80R; Frequency Stability: 50ppm; Tolerance: 20ppm; Name: ABLS-8.000MHZ-K4T; Min Operating Temperature: -20°C; Lead Free: Lead Free; Operating Frequency: 8 MHz; Width: 4.7mm; Packaging: Tape and Reel; Series: ABLS; Accuracy: 20ppm; Length: 11.4mm; Frequency Tolerance: 20ppm; Termination: SMD/SMT; Number of Pins: 2; Radiation Hardening: No; Depth: 4.7mm; REACH SVHC: No SVHC; Contact Plating: Tin; Load Capacitance: 18pF; Case/Package: SMD/SMT; Mount: Surface Mount; Package Quantity: 1000; Max Operating Temperature: 70°C; Height: 0.165inch; Frequency: 8MHz; Series Resistance: 80R; Manufacturer Part Number 1: ABLS-8.000MHZ-K4T; Supplier 1: Digi-Key; Supplier Part Number 1: 535-9937-1-ND; Supplier Unit Price 1: $0.4

## Sheet 3_IMU.SchDoc
size A4; SheetNumber: 4; SheetTotal: 6
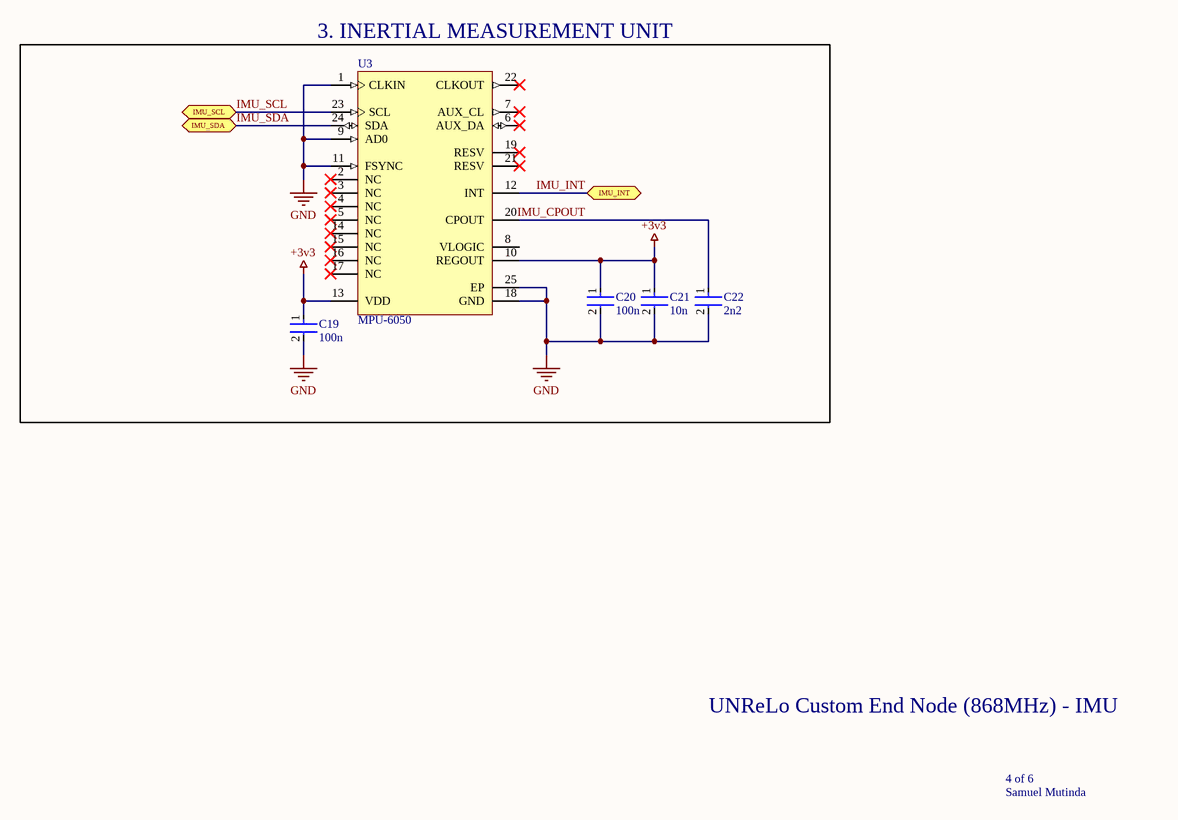
[diagram p3: 3_IMU.SchDoc]

### Parts
C19  100n  [FP-C0402-BB-MFG]
C20  100n  [FP-C0402-BB-MFG]
C21  10n  [FP-C0402-BB-MFG]
C22  2n2  [FP-C0402-BB-MFG]
U3  MPU-6050  [IS-QFN-24_V]

### Blocks framed on the sheet
3. INERTIAL MEASUREMENT UNIT: C19-C22 U3

### Ports
IMU_INT (bidir), IMU_SCL (bidir), IMU_SDA (bidir)

### Nets
+3v3: C19.1 C20.1 C21.1 U3.10(REGOUT) U3.13(VDD)
GND: C19.2 C20.2 C21.2 C22.2 U3.1(CLKIN) U3.9(AD0) U3.11(FSYNC) U3.18(GND) U3.25(EP)
IMU_CPOUT: C22.1 U3.20(CPOUT)
IMU_INT: U3.12(INT) ; port IMU_INT
IMU_SCL: U3.23(SCL) ; port IMU_SCL
IMU_SDA: U3.24(SDA) ; port IMU_SDA

Not connected (* = marked no-connect by the designer): U3 2(NC)* 3(NC)* 4(NC)* 5(NC)* 6(AUX_DA)* 7(AUX_CL)* 8(VLOGIC) 14(NC)* 15(NC)* 16(NC)* 17(NC)* 19(RESV)* 21(RESV)* 22(CLKOUT)*

### Notes on the sheet
- UNReLo Custom End Node (868MHz) - IMU
- 4 of 6
- Samuel Mutinda

### Library data of the parts
C19 = CMP-1034-02068-3: CAP CER 0.1UF 16V 5% X7R 0402; Manufacturer 1: TDK Corporation; Value: 0.10 μF; Temperature Coefficient: 15%; Tolerance: 0.05; Material: Ceramic; Name: CGA2B1X7R1C104K050BC; ComponentLink2URL: https://content.kemet.com/datasheets/KEM_C1002_X7R_SMD.pdf; Automotive: No; Device Class L2: Capacitors; Temperature: -55°C to +125°C; RoHS: TRUE; Voltage Rating: 16 V; ComponentLink2Description: Datasheet; Device Class L3: Ceramic Capacitors; Temperature Range Low: -55°C; Ipc Land Pattern Name: CAPC10050X50; Device Class L1: Passive Components; Temperature Range High: +125°C; Package: C0402-BB; Capacitance: 0.10 μF; Category: Cap; Mouser Description: CAP CER 0.1UF 16V X7R 0402; Height: 0.55mm; Digikey Description: CAP CER 0.1UF 16V 5% X7R 0402; Octopart: https://octopart.com/c0402c104j4ractu-kemet-12573893; Temperature Characteristic: X7R; Lead Free: Yes; Manufacturer Part Number 1: CGA2B1X7R1C104K050BC; Supplier 1: Digi-Key; Supplier Part Number 1: 445-5613-1-ND; Supplier Unit Price 1: $0.1
C20 = CMP-1034-02068-3: CAP CER 0.1UF 16V 5% X7R 0402; Manufacturer 1: TDK Corporation; Manufacturer Part Number: C0402C104J4RACTU; Value: 0.10 μF; Temperature Coefficient: 15%; Tolerance: 0.05; Material: Ceramic; Name: CGA2B1X7R1C104K050BC; ComponentLink2URL: https://content.kemet.com/datasheets/KEM_C1002_X7R_SMD.pdf; Automotive: No; Device Class L2: Capacitors; Temperature: -55°C to +125°C; RoHS: TRUE; Voltage Rating: 16 V; ComponentLink2Description: Datasheet; Device Class L3: Ceramic Capacitors; Temperature Range Low: -55°C; Ipc Land Pattern Name: CAPC10050X50; Device Class L1: Passive Components; Temperature Range High: +125°C; Package: C0402-BB; Capacitance: 0.10 μF; Category: Cap; Mouser Description: CAP CER 0.1UF 16V X7R 0402; Height: 0.55mm; Digikey Description: CAP CER 0.1UF 16V 5% X7R 0402; Octopart: https://octopart.com/c0402c104j4ractu-kemet-12573893; Temperature Characteristic: X7R; Lead Free: Yes; Manufacturer Part Number 1: CGA2B1X7R1C104K050BC; Supplier 1: Digi-Key; Supplier Part Number 1: 445-5613-1-ND; Supplier Unit Price 1: $0.1
C21 = CMP-1034-02068-3: CAP CER 0402 10NF 50V X7R 5%; Manufacturer 1: KEMET; Manufacturer Part Number: C0402C104J4RACTU; Value: 0.01 μF; Temperature Coefficient: 15%; Tolerance: 0.05; Material: Ceramic; Name: C0402C103J5RECAUTO; ComponentLink2URL: https://content.kemet.com/datasheets/KEM_C1002_X7R_SMD.pdf; Automotive: No; Device Class L2: Capacitors; Temperature: -55°C to +125°C; RoHS: TRUE; Voltage Rating: 50 V; ComponentLink2Description: Datasheet; Device Class L3: Ceramic Capacitors; Temperature Range Low: -55°C; Ipc Land Pattern Name: CAPC10050X50; Device Class L1: Passive Components; Temperature Range High: +125°C; Package: C0402-BB; Capacitance: 0.01 μF; Category: Cap; Mouser Description: CAP CER 0402 10NF 50V X7R 5%; Height: 0.55mm; Digikey Description: CAP CER 0402 10NF 50V X7R 5%; Octopart: https://octopart.com/c0402c104j4ractu-kemet-12573893; Temperature Characteristic: X7R; Lead Free: Yes; Manufacturer Part Number 1: C0402C103J5RECAUTO; Supplier 1: Digi-Key; Supplier Part Number 1: 399-C0402C103J5RECAUTOCT-ND; Supplier Unit Price 1: $0.18
C22 = CMP-1034-02068-3: CAP CER 0.1UF 16V 5% X7R 0402; Manufacturer 1: KEMET; Value: 2.2 nF; Voltage Rating: 25 V; Temperature Coefficient: 15%; Tolerance: 0.05; Material: Ceramic; Name: C0402C222K3RECAUTO; ComponentLink2URL: https://content.kemet.com/datasheets/KEM_C1002_X7R_SMD.pdf; Automotive: No; Device Class L2: Capacitors; Temperature: -55°C to +125°C; RoHS: TRUE; ComponentLink2Description: Datasheet; Device Class L3: Ceramic Capacitors; Temperature Range Low: -55°C; Ipc Land Pattern Name: CAPC10050X50; Device Class L1: Passive Components; Temperature Range High: +125°C; Package: C0402-BB; Capacitance: 2.2 nF; Category: Cap; Mouser Description: CAP CER 0402 2.2NF 25V X7R 10%; Height: 0.55mm; Digikey Description: CAP CER 0402 2.2NF 25V X7R 10%; Octopart: https://octopart.com/c0402c104j4ractu-kemet-12573893; Temperature Characteristic: X7R; Lead Free: Yes; Manufacturer Part Number 1: C0402C222K3RECAUTO; Supplier 1: Digi-Key; Supplier Part Number 1: 399-C0402C222K3RECAUTOCT-ND; Supplier Unit Price 1: $0.15
U3 = CMP-1753-00002-2: 3-Axis Gyroscope, Accelerometer and a Digital Motion Processor(TM) (DMP), 2.375 to 3.46 V, -40 to 85 degC, 24-Pin QFN, RoHS, Tape and Reel; Manufacturer 1: TDK InvenSense; Featured Product: MPU-60506-Axis,IntegratedI²CSolution; Other Names: 1428-1007-2 / MPU6050; Sensor Type: MotionTracking; Online Catalog: MPU-6000™Series; Unit PriceUSD: Digital; Datasheet Version: Rev. 3.3, 05/2012; Category: Sensors,Transducers; Datasheet URL: http://datasheet.octopart.com/MPU-6050-InvenSense-datasheet-14421344.pdf; Family: Multifunction; Standard Package: 5,000; Manufacturer URL: http://www.invensense.com/; Output Type: Digital; Dynamic Catalog: MPU-6000™Series; Name: MPU-6050; Manufacturer Part Number 1: MPU-6050; Supplier 1: Digi-Key; Supplier Part Number 1: 1428-1007-1-ND; Supplier Unit Price 1: $9.11

## Sheet 4_RFM95W.SchDoc
size A4; SheetNumber: 5; SheetTotal: 6
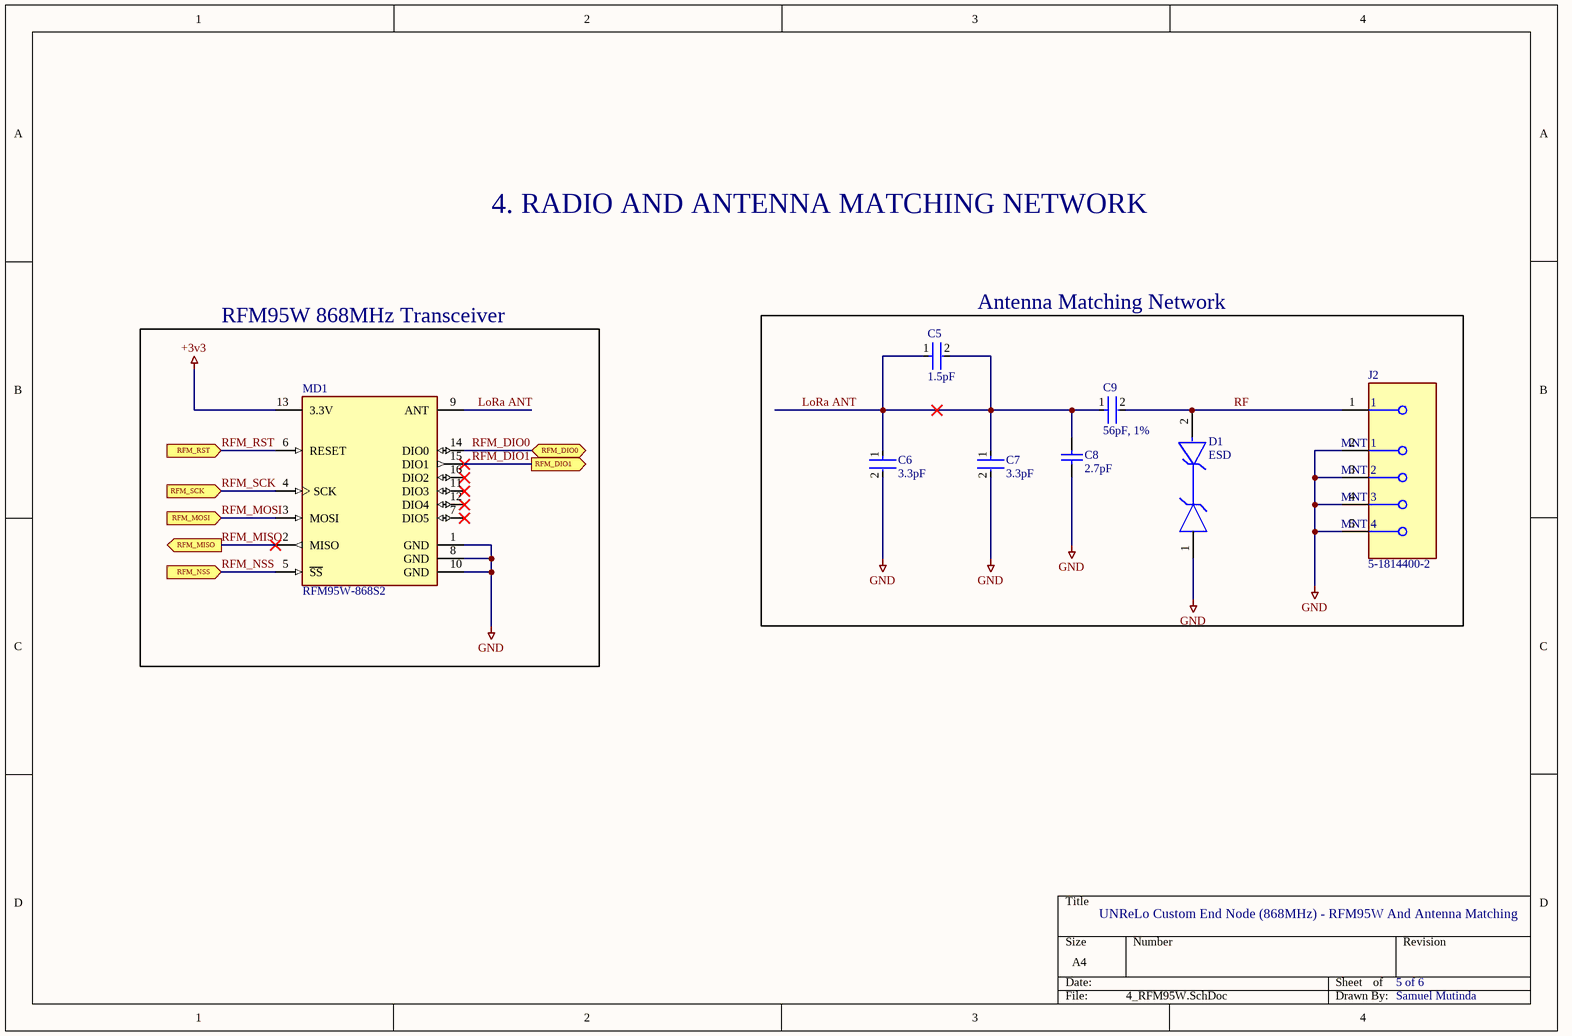
[diagram p4: 4_RFM95W.SchDoc]

### Parts
C5  1.5pF  [FP-GJM155-0_05-IPC_C]
C6  3.3pF  [FP-C0603C-CF-MFG]
C7  3.3pF  [FP-C0603C-CF-MFG]
C8  2.7pF  [CAPC1006X50X20ML10T10]
C9  56pF, 1%  [FP-C0603C-CF-MFG]
D1  ESD  [FP-711AM-CA-MFG]
J2  5-1814400-2  [FP-5-1814400-2-MFG]
MD1  RFM95W-868S2  [FP-RFM95W-868S2-MFG]

### Blocks framed on the sheet
RFM95W 868MHz Transceiver: MD1
Antenna Matching Network: C5-C9 D1 J2

### Ports
RFM_DIO0 (bidir), RFM_DIO1 (out), RFM_MISO (out), RFM_MOSI (in), RFM_NSS (in), RFM_RST (in), RFM_SCK (in)

### Nets
+3v3: MD1.13(3.3V)
GND: C6.2 C7.2 C8.1 D1.1 J2.2(MNT_1) J2.3(MNT_2) J2.4(MNT_3) J2.5(MNT_4) MD1.1(GND) MD1.8(GND) MD1.10(GND)
LoRa ANT: C5.1 C5.2 C6.1 C7.1 C8.2 C9.1 MD1.9(ANT)
RF: C9.2 D1.2 J2.1
RFM_DIO0: MD1.14(DIO0) ; port RFM_DIO0
RFM_DIO1: MD1.15(DIO1) ; port RFM_DIO1
RFM_MISO: MD1.2(MISO) ; port RFM_MISO
RFM_MOSI: MD1.3(MOSI) ; port RFM_MOSI
RFM_NSS: MD1.5(~{SS}) ; port RFM_NSS
RFM_RST: MD1.6(RESET) ; port RFM_RST
RFM_SCK: MD1.4(SCK) ; port RFM_SCK

Not connected (* = marked no-connect by the designer): MD1 7(DIO5)* 11(DIO3)* 12(DIO4)* 16(DIO2)*

### Notes on the sheet
- 4. RADIO AND ANTENNA MATCHING NETWORK
- UNReLo Custom End Node (868MHz) - RFM95W And Antenna Matching
- 5 of 6
- Samuel Mutinda

### Library data of the parts
C5 = CMP-2008-03820-2: Multi-Layer Ceramic Capacitor 1.5pF C0G  ±0.1pF 0402 Paper T/R; Manufacturer 1: KEMET; Temperature Coefficient: 30ppm/°C; Voltage Rating: 50V; Name: CBR04C159B5GAC; Depth: 0.5mm; Case Code (Imperial): 0402; Package Quantity: 10000; Length: 1mm; Number of Pins: 2; Max Operating Temperature: 125°C; Mount: Surface Mount; Construction: Flat; Thickness: 0.022inch; Series: GJM; Packaging: Tape and Reel; Radiation Hardening: No; REACH SVHC: No SVHC; Case/Package: 0402; Lead Free: Lead Free; Voltage Rating (DC): 50V; Min Operating Temperature: -55°C; Dielectric: C0G; Termination: SMD/SMT; Width: 0.5mm; Capacitance: 1.5pF; Lead Pitch: 0.3mm; Case Code (Metric): 1005; Voltage: 50V; Height: 0.5mm; Manufacturer Part Number 1: CBR04C159B5GAC; Supplier 1: Digi-Key; Supplier Part Number 1: 399-CBR04C159B5GACCT-ND; Supplier Unit Price 1: $0.17
C6 = CMP-1035-00238-3: CAP CER 3.3PF 50V NP0 0603; Manufacturer 1: KEMET; Tolerance: 0.25 pF; Material: Ceramic; Temperature Characteristic: C0G; Automotive Grade: Grade 1; Temperature Coefficient: 30ppm/°C; Name: C0603C339C5GACTU; Height: 0.87mm; Category: Cap; Automotive: Yes; Voltage Rating: 50 V; Capacitance: 3.3 pF; ComponentLink2Description: Datasheet; Octopart: https://octopart.com/c0603c339c5gactu-kemet-3701205; Temperature Range Low: -55°C; Device Class L3: Ceramic Capacitors; Package: C0603C-CF; Temperature: -55°C to +125°C; Digikey Description: CAP CER 3.3PF 50V NP0 0603; Temperature Range High: +125°C; ComponentLink2URL: https://api.kemet.com/component-edge/download/datasheet/C0603C100J5GACAUTO.pdf; Device Class L1: Passive Components; Value: 3.3 pF; RoHS: TRUE; Lead Free: Yes; Mouser Description: Multilayer Ceramic Capacitors MLCC - SMD/SMT 50volts 3.3pF C0G 0.25%; Device Class L2: Capacitors; Manufacturer Part Number 1: C0603C339C5GACTU; Supplier 1: Digi-Key; Supplier Part Number 1: 399-C0603C339C5GAC7867CT-ND; Supplier Unit Price 1: $0.34
C7 = CMP-1035-00238-3: CAP CER 3.3PF 50V NP0 0603; Manufacturer 1: KEMET; Tolerance: 0.25 pF; Material: Ceramic; Temperature Characteristic: C0G; Automotive Grade: Grade 1; Temperature Coefficient: 30ppm/°C; Name: C0603C339C5GAC7867; Height: 0.87mm; Category: Cap; Automotive: Yes; Voltage Rating: 50 V; Capacitance: 3.3 pF; ComponentLink2Description: Datasheet; Octopart: https://octopart.com/c0603c339c5gactu-kemet-3701205; Temperature Range Low: -55°C; Device Class L3: Ceramic Capacitors; Package: C0603C-CF; Temperature: -55°C to +125°C; Digikey Description: CAP CER 3.3PF 50V NP0 0603; Temperature Range High: +125°C; ComponentLink2URL: https://api.kemet.com/component-edge/download/datasheet/C0603C100J5GACAUTO.pdf; Device Class L1: Passive Components; Value: 3.3 pF; RoHS: TRUE; Lead Free: Yes; Mouser Description: Multilayer Ceramic Capacitors MLCC - SMD/SMT 50volts 3.3pF C0G 0.25%; Device Class L2: Capacitors; Manufacturer Part Number 1: C0603C339C5GAC7867; Supplier 1: Digi-Key; Supplier Part Number 1: 399-C0603C339C5GAC7867CT-ND; Supplier Unit Price 1: $0.34
C8 = CMP-2008-04788-1: Manufacturer: AVX Interconnect / Elco; Manufacturer 1: KEMET; Name: CBR04C279B5GAC; Manufacturer Part Number 1: CBR04C279B5GAC; Supplier 1: Digi-Key; Supplier Part Number 1: 399-14751-1-ND; Supplier Unit Price 1: $0.15
C9 = CMP-2006-03385-2: CAP CER 56PF 50V 1% NP0 0603; Manufacturer 1: KEMET; Material: Ceramic; Tolerance: 0.01; Temperature Coefficient: 30ppm/°C; Automotive Grade: Grade 1; Temperature Characteristic: C0G; Name: C0603C560F5GAC7867; Capacitance: 56 pF; ComponentLink2Description: Datasheet; Package: C0603C-CF; Lead Free: Yes; Digikey Description: CAP CER 56PF 50V 1% NP0 0603; Mouser Description: Multilayer Ceramic Capacitors MLCC - SMD/SMT 50volts 56pF C0G 1%; Value: 56 pF; Temperature Range High: +125°C; Category: Cap; Temperature Range Low: -55°C; RoHS: TRUE; ComponentLink2URL: https://api.kemet.com/component-edge/download/datasheet/C0603C100J5GACAUTO.pdf; Device Class L1: Passive Components; Device Class L2: Capacitors; Temperature: -55°C to +125°C; Device Class L3: Ceramic Capacitors; Height: 0.87mm; Octopart: https://octopart.com/c0603c560f5gactu-kemet-9143760; Automotive: Yes; Voltage Rating: 50 V; Manufacturer Part Number 1: C0603C560F5GAC7867; Supplier 1: Digi-Key; Supplier Part Number 1: 399-C0603C560F5GAC7867CT-ND; Supplier Unit Price 1: $0.22
D1 = CMP-07200-000004-1: TVS DIODE 5.3V 2XDFN; Manufacturer 1: onsemi; Direction: Bidirectional; Number Of Channels: 1; Max Junction Temp: +150°C; Breakdown Voltage: 7V; Automotive Grade: Grade 0; Capacitance: 0.24pF; Clamping Voltage: 13V; Value: 0.24pF; Name: SZESD7471N2T5G; Package: 711AM-CA; Digikey Description: TVS DIODE 5.3V 2XDFN; Device Class L1: Circuit Protection; Automotive: Yes; Device Class L3: unset; ComponentLink2Description: Datasheet; Temperature Range High: +150°C; Height: 0.44mm; Device Class L2: TVS Diodes; Reverse Standoff Voltage: 5.3V; RoHS: TRUE; Mouser Description: Ultra-Low Capacitance ESD Protection low cap ESD protection in SOD-882; ComponentLink2URL: https://datasheet.octopart.com/SZESD7471N2T5G-ON-Semiconductor-datasheet-32011129.pdf; Temperature: -55°C to +150°C; Lead Free: Yes; Temperature Range Low: -55°C; Category: Diode; Footprint Url: https://www.onsemi.com/pub/Collateral/711AM.PDF; Octopart: https://octopart.com/szesd7471n2t5g-on+semiconductor-47358903; Manufacturer Part Number 1: SZESD7471N2T5G; Supplier 1: Digi-Key; Supplier Part Number 1: SZESD7471N2T5GOSCT-ND; Supplier Unit Price 1: $0.43
J2 = CMP-03357-000009-1: CONN SMA JACK R/A 50 OHM PCB; Manufacturer 1: TE Connectivity AMP Connectors; Name: 5-1814400-2; Manufacturer Part Number 1: 5-1814400-2; Supplier 1: Digi-Key; Supplier Part Number 1: 17-5-1814400-2CT-ND; Supplier Unit Price 1: $4.54
MD1 = CMP-204316-000001-1: RX TXRX MODULE ISM < 1GHZ SMD; Manufacturer 1: HOPEMICROELECTRONICS; Data Rate: 300Kbps; Frequency: 868MHz; Sensitivity: -123dBm; Interface: SPI; Current - Transmitting: 120mA; Current - Receiving: 12.1mA; Name: RFM95W-868S2R; Max Operating Temperature: 70°C; Case/Package: SMD/SMT; Packaging: Bulk; Mount: Surface Mount; Min Operating Temperature: -20°C; Manufacturer Part Number 1: RFM95W-868S2R; Supplier 1: Digi-Key; Supplier Part Number 1: RFM95W-868S2R; Supplier Unit Price 1: $8.24

## Sheet 5_External_MCU_Connections.SchDoc
size A4; SheetNumber: 6; SheetTotal: 6
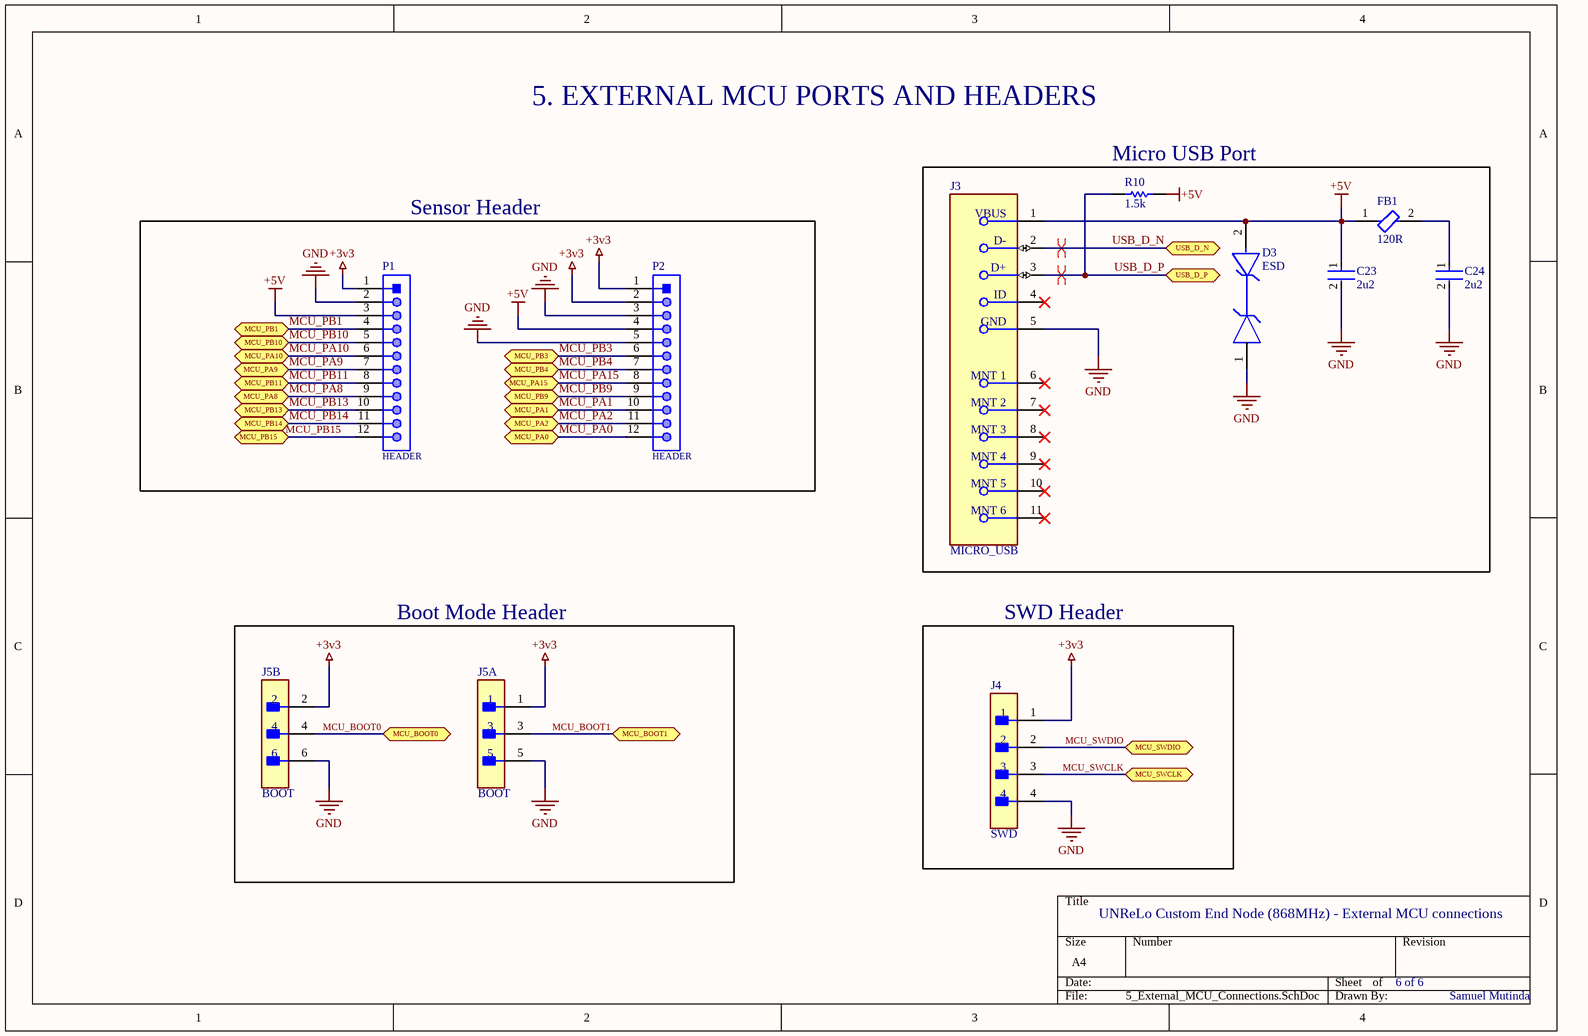
[diagram p5: 5_External_MCU_Connections.SchDoc]

### Parts
C23  2u2  [FP-C0603C225K4PACTU-MFG]
C24  2u2  [FP-C0603C225K4PACTU-MFG]
D3  ESD  [FP-711AM-CA-MFG]
FB1  120R  [FP-MMZ1005-IPC_B]
J3  MICRO_USB  [FP-473460001-MFG]
J4  SWD  [FP-47053-1000-MFG]
J5  BOOT  [FP-M20-9980346-MFG]  (parts A,B of 2)
P1  HEADER  [61301211121]
P2  HEADER  [61301211121]
R10  1.5k  [RESC1005X40X25ML05T10]

### Blocks framed on the sheet
Micro USB Port: C23 C24 D3 FB1 J3 R10
Sensor Header: P1 P2
Boot Mode Header: J5
SWD Header: J4

### Ports
MCU_BOOT0 (bidir), MCU_BOOT1 (bidir), MCU_PA0 (bidir), MCU_PA1 (bidir), MCU_PA2 (bidir), MCU_PA8 (bidir), MCU_PA9 (bidir), MCU_PA10 (bidir), MCU_PA15 (bidir), MCU_PB1 (bidir), MCU_PB3 (bidir), MCU_PB4 (bidir), MCU_PB9 (bidir), MCU_PB10 (bidir), MCU_PB11 (bidir), MCU_PB13 (bidir), MCU_PB14 (bidir), MCU_PB15 (bidir), MCU_SWCLK (bidir), MCU_SWDIO (bidir), USB_D_N (bidir), USB_D_P (bidir)

### Nets
+3v3: J4.1 J5.1 J5.2 P1.1 P2.1 P2.2
+5V: C23.1 D3.2 FB1.1 J3.1(VBUS) P1.3 P2.4 R10.2
GND: C23.2 C24.2 D3.1 J3.5(GND) J4.4 J5.5 J5.6 P1.2 P2.3 P2.5
MCU_BOOT0: J5.4 ; port MCU_BOOT0
MCU_BOOT1: J5.3 ; port MCU_BOOT1
MCU_PA0: P2.12 ; port MCU_PA0
MCU_PA1: P2.10 ; port MCU_PA1
MCU_PA2: P2.11 ; port MCU_PA2
MCU_PA8: P1.9 ; port MCU_PA8
MCU_PA9: P1.7 ; port MCU_PA9
MCU_PA10: P1.6 ; port MCU_PA10
MCU_PA15: P2.8 ; port MCU_PA15
MCU_PB1: P1.4 ; port MCU_PB1
MCU_PB3: P2.6 ; port MCU_PB3
MCU_PB4: P2.7 ; port MCU_PB4
MCU_PB9: P2.9 ; port MCU_PB9
MCU_PB10: P1.5 ; port MCU_PB10
MCU_PB11: P1.8 ; port MCU_PB11
MCU_PB13: P1.10 ; port MCU_PB13
MCU_PB14: P1.11 ; port MCU_PB14
MCU_PB15: P1.12 ; port MCU_PB15
MCU_SWCLK: J4.3 ; port MCU_SWCLK
MCU_SWDIO: J4.2 ; port MCU_SWDIO
USB_D_N: J3.2(D-) ; port USB_D_N
USB_D_P: J3.3(D+) R10.1 ; port USB_D_P
NetC24_1: C24.1 FB1.2

Not connected (* = marked no-connect by the designer): J3 4(ID)* 6(MNT_1)* 7(MNT_2)* 8(MNT_3)* 9(MNT_4)* 10(MNT_5)* 11(MNT_6)*

### Layout directives
differential pair; net class DIFF_USB: USB_D_N, USB_D_P

### Notes on the sheet
- 5. EXTERNAL MCU PORTS AND HEADERS
- UNReLo Custom End Node (868MHz) - External MCU connections
- 6 of 6
- Samuel Mutinda

### Library data of the parts
C23 C24 = CMP-2006-02259-2: as C10 on sheet 2_MCU; Series: C; Voltage Rating (DC): 16V; REACH SVHC: No SVHC; RoHS Compliant: Yes; Number of Pins: 2; Max Operating Temperature: 85°C; Voltage Rating: 16V; Min Operating Temperature: -55°C; Termination: SMD/SMT; Dielectric: X5R; Packaging: Tape and Reel; Contact Plating: Tin; Case Code (Metric): 1608; Height: 0.8mm; Capacitance: 2.2uF; Case/Package: 0603; Width: 0.8mm; Construction: Flat; Depth: 0.8mm; Thickness: 0.034inch; Radiation Hardening: No; Length: 1.6mm; Mount: Surface Mount; Case Code (Imperial): 0603; Voltage: 16V; Package Quantity: 1; Lead Free: Lead Free; Manufacturer Part Number 1: EMK107BB7225MA-T; Supplier 1: Digi-Key; Supplier Part Number 1: 587-4864-1-ND; Supplier Unit Price 1: $0.27
D3 = CMP-07200-000004-1: as D1 on sheet 4_RFM95W; Package: 711AM-CA; Digikey Description: TVS DIODE 5.3V 2XDFN; Device Class L1: Circuit Protection; Automotive: Yes; Device Class L3: unset; ComponentLink2Description: Datasheet; Temperature Range High: +150°C; Height: 0.44mm; Device Class L2: TVS Diodes; Reverse Standoff Voltage: 5.3V; RoHS: TRUE; Mouser Description: Ultra-Low Capacitance ESD Protection low cap ESD protection in SOD-882; ComponentLink2URL: https://datasheet.octopart.com/SZESD7471N2T5G-ON-Semiconductor-datasheet-32011129.pdf; Temperature: -55°C to +150°C; Lead Free: Yes; Temperature Range Low: -55°C; Category: Diode; Footprint Url: https://www.onsemi.com/pub/Collateral/711AM.PDF; Octopart: https://octopart.com/szesd7471n2t5g-on+semiconductor-47358903; Manufacturer Part Number 1: SZESD7471N2T5G; Supplier 1: Digi-Key; Supplier Part Number 1: SZESD7471N2T5GOSCT-ND; Supplier Unit Price 1: $0.43
FB1 = CMP-08257-000110-1: Signal Line Ferrite Bead 120Ω @ 100MHz 500mA DCR 220mΩ SMD 0402; Manufacturer 1: Laird-Signal Integrity Products; DC Resistance (DCR): 250mR; Tolerance: 25%; Name: LI0402D121R-10; Series: MMZ; Height: 0.022inch; RoHS Compliant: Yes; Package Quantity: 1; REACH SVHC: No SVHC; Lead Free: Lead Free; Current Rating: 500mA; Packaging: Tape and Reel; Impedance: 120R; Case Code (Imperial): 0402; Width: 0.02inch; Max DC Current: 500mA; Core Material: Ferrite; Case Code (Metric): 1005; Depth: 0.5mm; Case/Package: 0402; Mount: Surface Mount; Length: 0.039inch; Manufacturer Part Number 1: LI0402D121R-10; Supplier 1: Digi-Key; Supplier Part Number 1: 240-2361-1-ND; Supplier Unit Price 1: $0.18
J3 = CMP-2000-05246-2: CONN RCPT USB2.0 MICRO B SMD R/A; Manufacturer 1: Molex; Conn Orientation: Right Angle; Is Female: yes; Shielding: true; Pitch: 0.65mm; Number Of Contacts: 5; Voltage Rating: 30V; Current Rating: 1.8A; Name: 0473460001; Device Class L2: USB Connectors; Digikey Description: CONN RCPT USB2.0 MICRO B SMD R/A; Height: 2.945mm; RoHS: TRUE; ComponentLink2Description: Datasheet; Octopart: https://octopart.com/47346-0001-molex-7164928; Automotive: No; Package: 0; Category: Conn; Device Class L1: Connectors; Usb Standard: USB 2.0; Temperature: -30°C to +85°C; Temperature Range Low: -30°C; Footprint Url: https://www.molex.com/pdm_docs/sd/473460001_sd.pdf; ComponentLink2URL: https://www.molex.com/webdocs/datasheets/pdf/en-us/0473460001_IO_CONNECTORS.pdf; Lead Free: Yes; Contact Material: Gold,Nickel; Temperature Range High: +85°C; Device Class L3: unset; Manufacturer Part Number 1: 0473460001; Supplier 1: Digi-Key; Supplier Part Number 1: WM17141CT-ND; Supplier Unit Price 1: $1.51
J4 = CMP-04776-000290-1: CONN HEADER VERT 4POS 2.54MM; Manufacturer 1: Sullins Connector Solutions; Number of Positions: 4; Voltage Rating (DC): 250V; Gender: Male; Current Rating: 4A; Glow Wire Compliant: Non-compliant; Name: PEC02DAAN; Contact Material: Brass; Contact Plating: Tin; Radiation Hardening: No; Package Quantity: 12000; Packaging: Bulk; Termination: Through Hole; Depth: 5.84mm; Series: 47053; Number of Contacts: 4; Length: 10.2mm; Halogen Free: Low Halogen; Number of Circuits: 4; Max Operating Temperature: 75°C; Housing Color: Beige; Min Operating Temperature: 0°C; Number of Rows: 1; Pitch: 2.54mm; Housing Material: Nylon; Orientation: Vertical; Mount: Through Hole; Voltage Rating: 250V; Manufacturer Part Number 1: PEC02DAAN; Supplier 1: Digi-Key; Supplier Part Number 1: S2012E-02-ND; Supplier Unit Price 1: $0.25
J5 = CMP-2000-06636-2: CONN HEADER VERT 6POS 2.54MM; Manufacturer 1: Harwin Inc.; Current Rating: 3A; Number Of Contacts: 6; Conn Gender: Male; Conn Orientation: Vertical; Name: M20-9980346; Device Class L1: Connectors; ComponentLink2Description: Datasheet; Height: 8.99mm; Temperature Range High: +105°C; Contact Material: Tin,Nickel; RoHS: TRUE; Temperature Range Low: -40°C; ComponentLink2URL: https://cdn.harwin.com/pdfs/M20-998.pdf; Digikey Description: CONN HEADER VERT 6POS 2.54MM; Pitch: 2.54mm; Package: M20-9980346; Device Class L2: Headers and Wire Housings; Number Of Rows: 2; Category: Conn; Lead Free: Yes; Mouser Description: 2.54mm (0.1") Pitch DIL Vertical PC Tail Pin Header, 6.1mm mating pin height, tin, 3+3 contacts; Temperature: -40°C to +105°C; Device Class L3: unset; Octopart: https://octopart.com/m20-9980346-harwin-5436545; Automotive: No; Manufacturer Part Number 1: M20-9980346; Supplier 1: Digi-Key; Supplier Part Number 1: 952-2121-ND; Supplier Unit Price 1: $0.3
P1 P2 = CMP-1502-01086-1: THT Vertical Pin Header WR-PHD, Pitch 2.54 mm, Single Row, 12 pins; Manufacturer 1: Würth Elektronik; Pin Number: 12; Gender: Male; Working Voltage: 250VAC; Rated Current: 3A; Withstanding Voltage: 500VAC; Pitch: 2.54mm; Contact Resistance: 20mOhm; Orientation: Vertical; Package Reference: 61301211121; Packaging: Bag; Operating Temperature: -40to105degC; Mounting Technology: THT; Manufacturer URL: http://www.we-online.de; Row Number: Single; Publisher: WurthElektronik; Datasheet URL: https://katalog.we-online.de/em/datasheet/6130xx11121.pdf; Name: 61301211121; Manufacturer Part Number 1: 61301211121; Supplier 1: Digi-Key; Supplier Part Number 1: 732-5323-ND; Supplier Unit Price 1: $0.57
R10 = CMP-2002-07464-1: Manufacturer: Yageo / Phycomp; Part Number: RC0402FR-071K5L; Manufacturer 1: YAGEO; Name: RC0402FR-071K5L; Manufacturer Part Number 1: RC0402FR-071K5L; Supplier 1: Digi-Key; Supplier Part Number 1: 311-1.50KLRCT-ND; Supplier Unit Price 1: $0.1